# EAGLE design TubeAmp_driver (EAGLE 7.2.0)
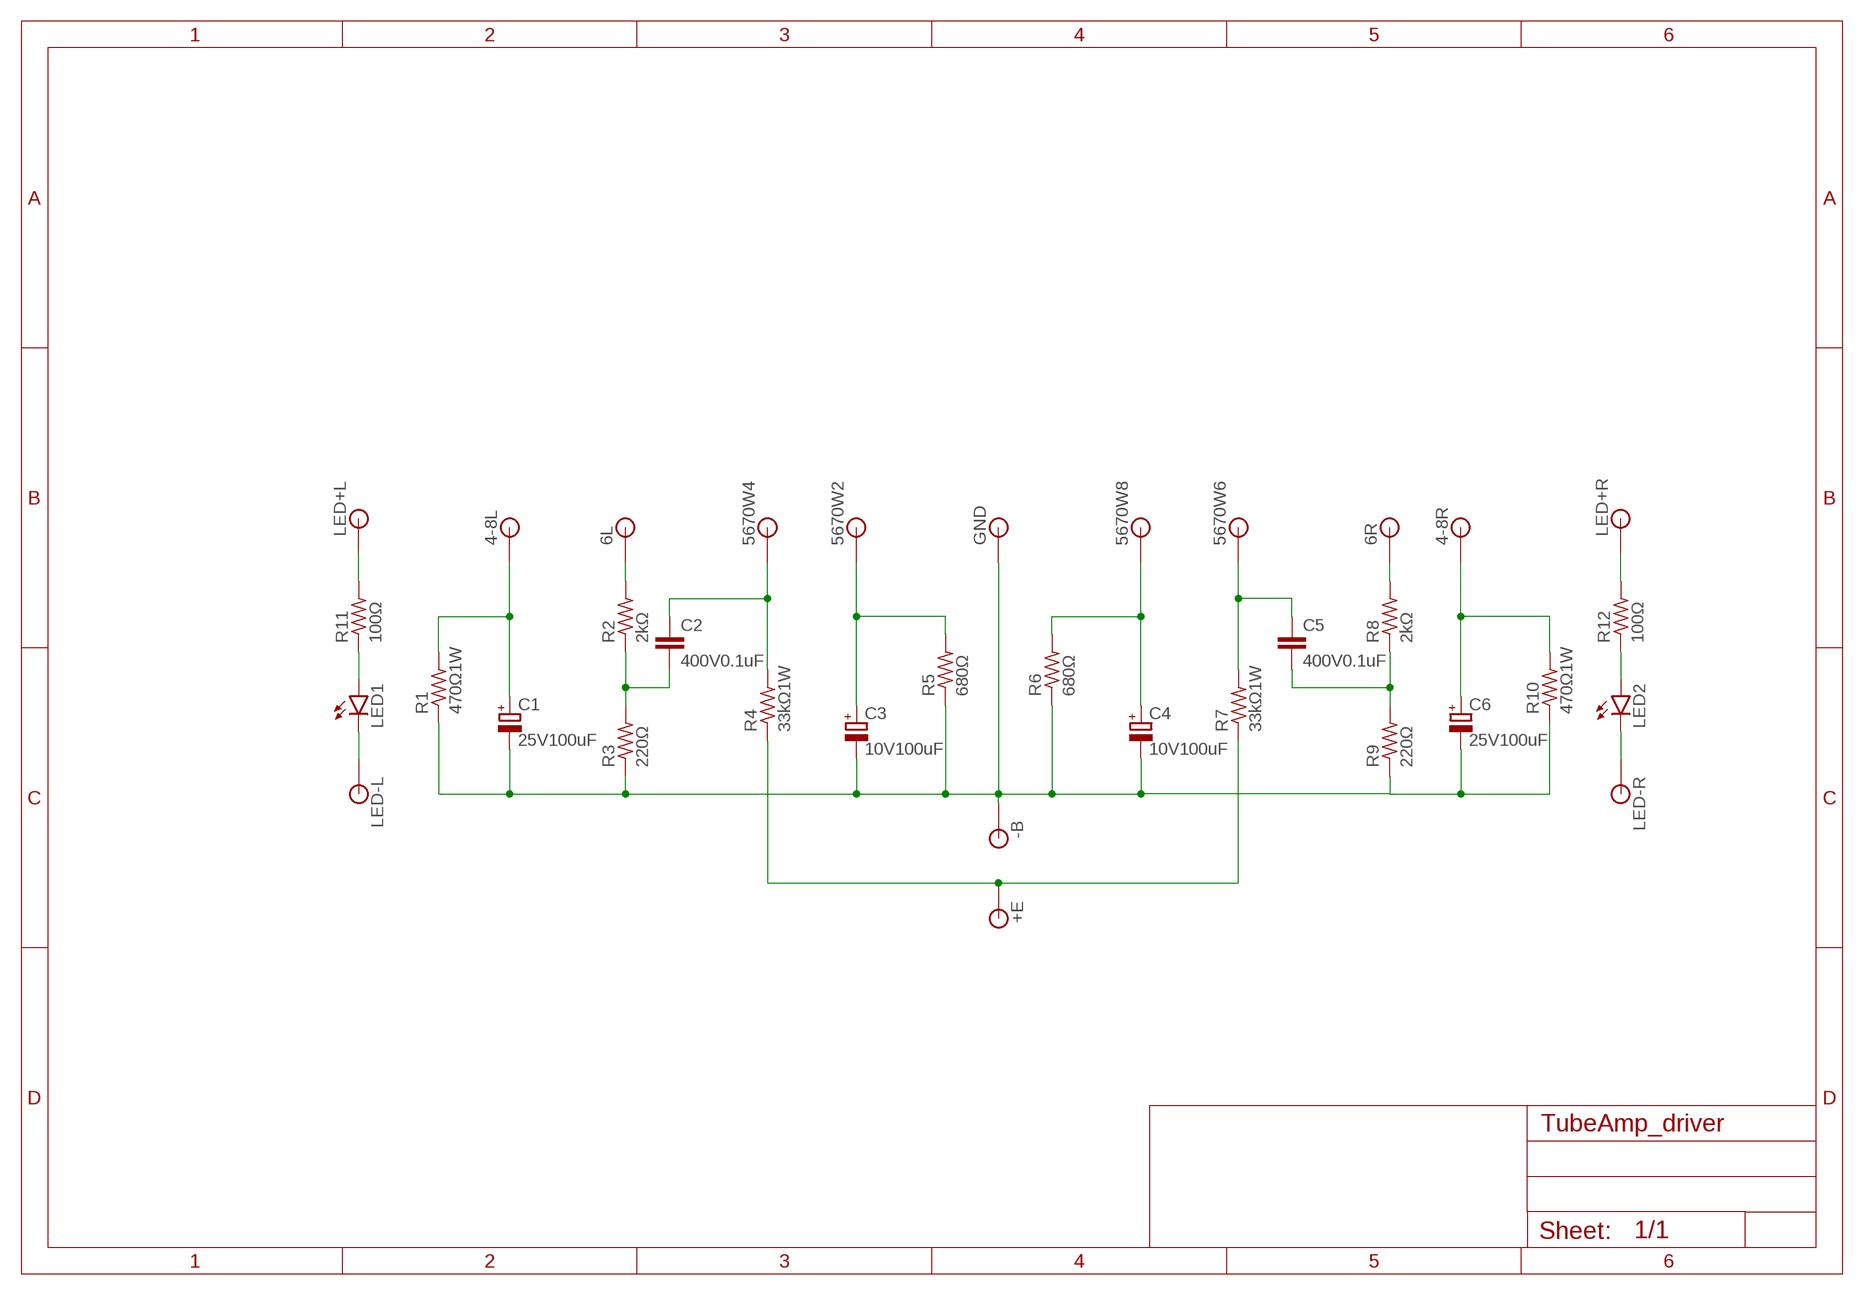
[diagram p0: schematic, sheet 1]

## Parts
4-8L  PIN-1X11.2MM  [PIN-1X1_1.2MM]
4-8R  PIN-1X11.2MM  [PIN-1X1_1.2MM]
6L  PIN-1X11.2MM  [PIN-1X1_1.2MM]
6R  PIN-1X11.2MM  [PIN-1X1_1.2MM]
5670W2  PIN-1X11.2MM  [PIN-1X1_1.2MM]
5670W4  PIN-1X11.2MM  [PIN-1X1_1.2MM]
5670W6  PIN-1X11.2MM  [PIN-1X1_1.2MM]
5670W8  PIN-1X11.2MM  [PIN-1X1_1.2MM]
+E  PIN-1X11.2MM  [PIN-1X1_1.2MM]
-B  PIN-1X11.2MM  [PIN-1X1_1.2MM]
C1  25V100uF  CPOL25_65  [CPOL25_65]
C2  400V0.1uF  C125_63X155  [C125_63X155]
C3  10V100uF  CPOL25_65  [CPOL25_65]
C4  10V100uF  CPOL25_65  [CPOL25_65]
C5  400V0.1uF  C125_63X155  [C125_63X155]
C6  25V100uF  CPOL25_65  [CPOL25_65]
GND  PIN-1X11.2MM  [PIN-1X1_1.2MM]
LED1  LED-3MM  [LED-3MM]
LED2  LED-3MM  [LED-3MM]
LED+L  PIN-1X11.2MM  [PIN-1X1_1.2MM]
LED+R  PIN-1X11.2MM  [PIN-1X1_1.2MM]
LED-L  PIN-1X11.2MM  [PIN-1X1_1.2MM]
LED-R  PIN-1X11.2MM  [PIN-1X1_1.2MM]
R1  470Ω1W  RESISTOR1W  [RESISTOR_1W]
R2  2kΩ  RESISTOR1/4W  [RESISTOR_1/4W]
R3  220Ω  RESISTOR1/4W  [RESISTOR_1/4W]
R4  33kΩ1W  RESISTOR1W  [RESISTOR_1W]
R5  680Ω  RESISTOR1/4W  [RESISTOR_1/4W]
R6  680Ω  RESISTOR1/4W  [RESISTOR_1/4W]
R7  33kΩ1W  RESISTOR1W  [RESISTOR_1W]
R8  2kΩ  RESISTOR1/4W  [RESISTOR_1/4W]
R9  220Ω  RESISTOR1/4W  [RESISTOR_1/4W]
R10  470Ω1W  RESISTOR1W  [RESISTOR_1W]
R11  100Ω  RESISTOR1/4W  [RESISTOR_1/4W]
R12  100Ω  RESISTOR1/4W  [RESISTOR_1/4W]

## Nets
4-8L [power]: 4-8L.1 C1.+ R1.2
4-8R [power]: 4-8R.1 C6.+ R10.2
6L [power]: 6L.1 R2.2
6R [power]: 6R.1 R8.2
5670W2 [power]: 5670W2.1 C3.+ R5.2
5670W4 [power]: 5670W4.1 C2.1 R4.2
5670W6 [GND]: 5670W6.1 C5.1 R7.2
5670W8 [power]: 5670W8.1 C4.+ R6.2
+E [power]: +E.1 R4.1 R7.1
-B [GND]: -B.1 C1.- C3.- C4.- C6.- GND.1 R1.1 R3.1 R5.1 R6.1 R9.1 R10.1
LED+L: LED+L.1 R11.2
LED+R: LED+R.1 R12.2
LED-L: LED1.K(C) LED-L.1
LED-R: LED2.K(C) LED-R.1
N$2 [power]: C2.2 R2.1 R3.2
N$6: LED1.A R11.1
N$7: LED2.A R12.1
N$11 [power]: C5.2 R8.1 R9.2

## Library data of the parts
4-8L 4-8R 6L 6R 5670W2 5670W4 5670W6 5670W8 +E -B GND LED+L LED+R LED-L LED-R = GClue:PIN-1X1
C1 C3 C4 C6 = GClue-TubeAmp:CPOL
C2 C5 = GClue-TubeAmp:C
LED1 LED2 = GClue:LED: LED
R1-R12 = GClue-TubeAmp:RESISTOR

## Net classes
0 default: width 0.305 mm
1 GND: width 0.635 mm, drill 0.152 mm
2 power: width 0.635 mm, drill 0.127 mm
3 edit: width 0.635 mm, drill 0.025 mm

## Board
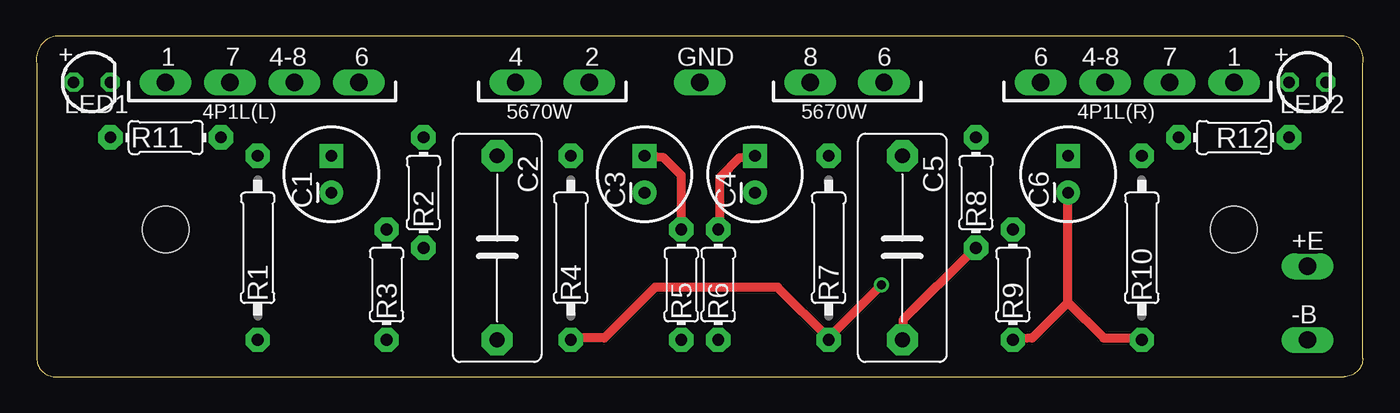
[diagram p1: board, top side]
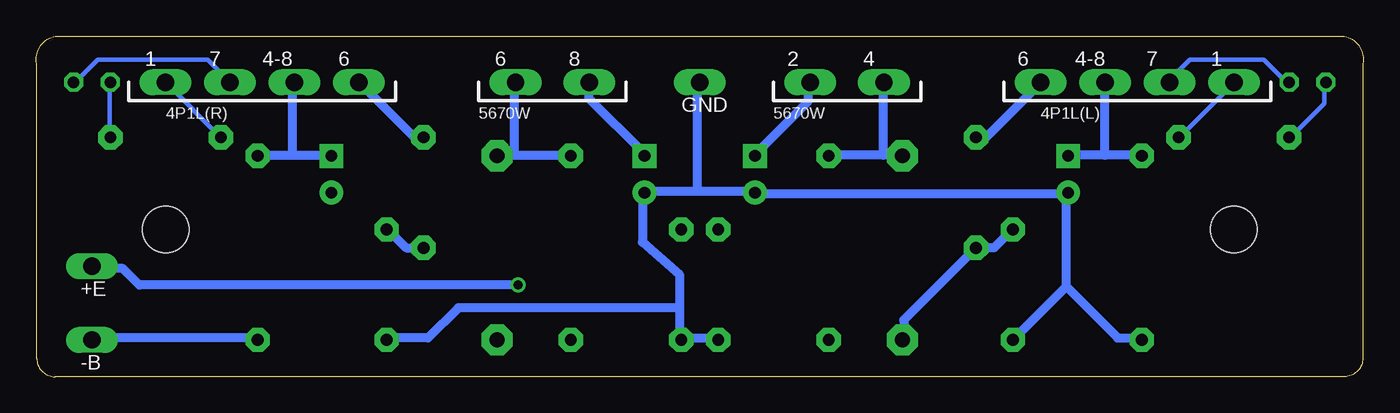
[diagram p2: board, bottom side, seen from below]

Size 91.5 x 23.5 mm. Coordinates in mm from the lower left corner, seen from the top.
Outline: 1.3,0 90.2,0 arc90 91.47,1.27 91.47,21.59 arc90 90.2,23.5 1.3,23.5 arc90 0.03,21.59 0.03,1.27 arc90 1.3,0
Copper layers (1*16): Top 0.035mm / dielectric 1.5mm / Bottom 0.035mm
Design rules "default *": minimum track width 10mil, minimum drill 24mil, track to track 16mil, track to pad 16mil, pad to pad 16mil, via to via 16mil, smd to smd 16mil, copper to edge 40mil, drill to drill 8mil, minimum pad ring 10mil, minimum via ring 8mil, stop-mask expansion 4mil, vias tented up to drill 0mil, thermal gap 10mil
Holes 3.2 mm at 8.92,10.16 82.58,10.16

### Footprints (pad centres in the part's own frame; a part is rotated, then mirrored left to right if it is on the bottom)
PIN-1X1_1.2MM = drill 1.2 long: 1 0,0
CPOL25_65 = drill 0.8 pad 1.651 square: + 1.27,0 | drill 0.8 pad 1.651: - -1.27,0
C125_63X155 = drill 1.016 pad 2.159 octagon: 1 -6.35,0; 2 6.35,0
LED-3MM = drill 0.8 octagon: A -1.27,0; K 1.27,0
RESISTOR_1W = drill 0.813 pad 1.676 octagon: 1 -6.35,0; 2 6.35,0
RESISTOR_1/4W = drill 0.813 pad 1.676 octagon: 1 -3.81,0; 2 3.81,0

### Placement (x,y rotation side)
4-8L  17.81,20.32 0 top
4-8R  73.69,20.32 0 top
6L  22.26,20.32 0 top
6R  69.25,20.32 0 top
5670W2  38.13,20.32 0 top
5670W4  33.05,20.32 0 top
5670W6  58.45,20.32 0 top
5670W8  53.37,20.32 0 top
+E  87.66,7.62 0 top
-B  87.66,2.54 0 top
C1  20.35,13.97 90 top
C2  31.78,8.89 270 top
C3  41.94,13.97 90 top
C4  49.56,13.97 90 top
C5  59.72,8.89 270 top
C6  71.15,13.97 90 top
GND  45.75,20.32 0 top
LED1  3.84,20.32 0 top
LED2  87.66,20.32 0 top
LED+L  8.92,20.32 0 top
LED+R  82.58,20.32 0 top
LED-L  13.37,20.32 0 top
LED-R  78.14,20.32 0 top
R1  15.27,8.89 90 top
R2  26.7,12.7 90 top
R3  24.16,6.35 90 top
R4  36.86,8.89 90 top
R5  44.48,6.35 90 top
R6  47.02,6.35 90 top
R7  54.64,8.89 90 top
R8  64.8,12.7 90 top
R9  67.34,6.35 90 top
R10  76.23,8.89 90 top
R11  8.92,16.51 0 top
R12  82.58,16.51 180 top

### Tracks (layer width: path | path; a pad name or v marks a point on that pad's centre or on a via)
4-8L
  Bottom 0.635: 17.81,15.29 15.32,15.29 R1.2 | 17.81,15.29 20.3,15.29 C1.+ | 17.81,15.29 4-8L.1
4-8R
  Bottom 0.635: 73.82,15.29 76.13,15.29 R10.2 | 73.82,15.29 71.15,15.29 C6.+ | 73.82,15.29 73.82,20.27 4-8R.1
6L
  Bottom 0.635: R2.2 26.7,16.54 25.99,16.54 22.26,20.27 6L.1
6R
  Bottom 0.635: 6R.1 65.46,16.54 64.93,16.54 R8.2
5670W2
  Top 0.635: R5.2 44.48,13.89 43.26,15.11 C3.+
  Bottom 0.635: 5670W2.1 38.26,20.27 38.26,19.02 41.81,15.47 C3.+
5670W4
  Bottom 0.635: 33.1,15.29 31.86,15.29 C2.1 | 33.1,15.29 36.84,15.29 R4.2 | 33.1,15.29 33.1,20.27 5670W4.1
5670W6
  Bottom 0.635: 58.53,15.29 59.59,15.29 C5.1 | 58.53,15.29 54.79,15.29 R7.2 | 58.53,15.29 58.53,20.27 5670W6.1
5670W8
  Top 0.635: C4.+ 48.51,15.11 47.15,13.75 47.15,10.31 R6.2
  Bottom 0.635: 5670W8.1 53.37,19.2 49.64,15.47 C4.+
+E  (via drill 0.61)
  Top 0.635: R4.1 37.01,2.67 39.17,2.67 42.68,6.17 51.11,6.17 54.62,2.67 R7.1 54.79,2.85 v58.27,6.33
  Bottom 0.635: v58.27,6.33 84.4,6.33 85.54,7.47 87.51,7.47 +E.1
-B
  Top 0.635: 71.15,5.13 C6.- | 71.15,5.13 68.69,2.67 R9.1 | 71.15,5.13 73.62,2.67 76.13,2.67 R10.1
  Bottom 0.635: -B.1 87.51,2.67 76.49,2.67 R10.1 | 20.48,6.22 20.48,12.62 | R3.1 20.48,6.22 | 20.48,6.22 16.92,2.67 15.32,2.67 R1.1 | R5.1 44.48,2.67 46.97,2.67 R6.1 47.15,2.67 47.15,4.76 | 45.9,12.8 49.46,12.8 C4.- 49.7,12.62 49.7,9.28 47.15,7.05 47.15,4.76 | 45.9,12.8 41.99,12.8 C3.- 41.64,12.62 20.48,12.62 | 45.9,12.8 45.9,20.27 GND.1 | 20.48,12.62 C1.- | 47.15,4.76 62.39,4.76 64.48,2.67 67.24,2.67 R9.1
LED+L
  Bottom 0.305: R11.2 12.66,16.54 8.92,20.27 LED+L.1
LED+R
  Bottom 0.305: LED+R.1 R12.2
LED-L
  Bottom 0.305: LED1.K 5.19,20.45 5.44,20.45 6.86,21.87 11.94,21.87 13.37,20.45 LED-L.1
LED-R
  Bottom 0.305: LED-R.1 79.69,21.87 87.26,21.87 88.68,20.45 88.93,20.45 LED2.K
N$2
  Bottom 0.635: R3.2 24.21,10.13 25.46,8.89 R2.1 31.68,3.91 31.68,2.67 C2.2
N$6
  Bottom 0.305: LED1.A 2.7,20.27 2.7,18.85 5.01,16.54 R11.1
N$7
  Bottom 0.305: LED2.A 86.44,20.27 86.44,16.54 R12.1
N$11
  Top 0.635: C5.2 59.77,2.67 59.77,3.91 64.57,8.71 R8.1
  Bottom 0.635: R8.1 66,8.89 67.24,10.13 R9.2

### Text on the board
tPlace: + | + | 1 | 7 | 4-8 | 6 | 4 | 2 | GND | 8 | 6 | 6 | 4-8 | 7 | 1 | 4P1L(L) | 5670W | 5670W | 4P1L(R) | +E | -B
bPlace: 1 | 7 | 4-8 | 6 | 4 | 2 | 8 | 6 | 6 | 4-8 | 7 | 1 | 4P1L(L) | 5670W | GND | 5670W | 4P1L(R) | +E | -B